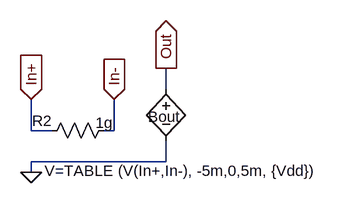
[diagram p0: schematic Comph.asc]
Comph.asc, the LTspice schematic file:
Version 4
SHEET 1 880 680
WIRE -16 304 -16 256
WIRE -16 368 -16 352
WIRE 16 304 -16 304
WIRE 112 304 96 304
WIRE 112 304 112 256
WIRE 192 240 192 208
WIRE 192 352 -16 352
WIRE 192 352 192 320
FLAG -16 256 In+
IOPIN -16 256 In
FLAG 112 256 In-
IOPIN 112 256 In
FLAG 192 208 Out
IOPIN 192 208 Out
FLAG -16 368 0
SYMBOL res 112 288 R90
WINDOW 0 16 111 VBottom 0
WINDOW 3 -12 15 VTop 0
SYMATTR InstName R2
SYMATTR Value 1g
SYMBOL bv 192 224 R0
WINDOW 0 -28 59 Left 0
WINDOW 3 -187 142 Left 0
SYMATTR InstName Bout
SYMATTR Value V=TABLE (V(In+,In-), -5m,0,5m, {Vdd})

The netlist it stands for:
* Comph.asc
R2 In- In+ 1g
Bout Out 0 V=TABLE (V(In+,In-), -5m,0,5m, {Vdd})
.backanno
.end